# EAGLE schematic powersupplyboardinprogress (EAGLE 8.6.0)
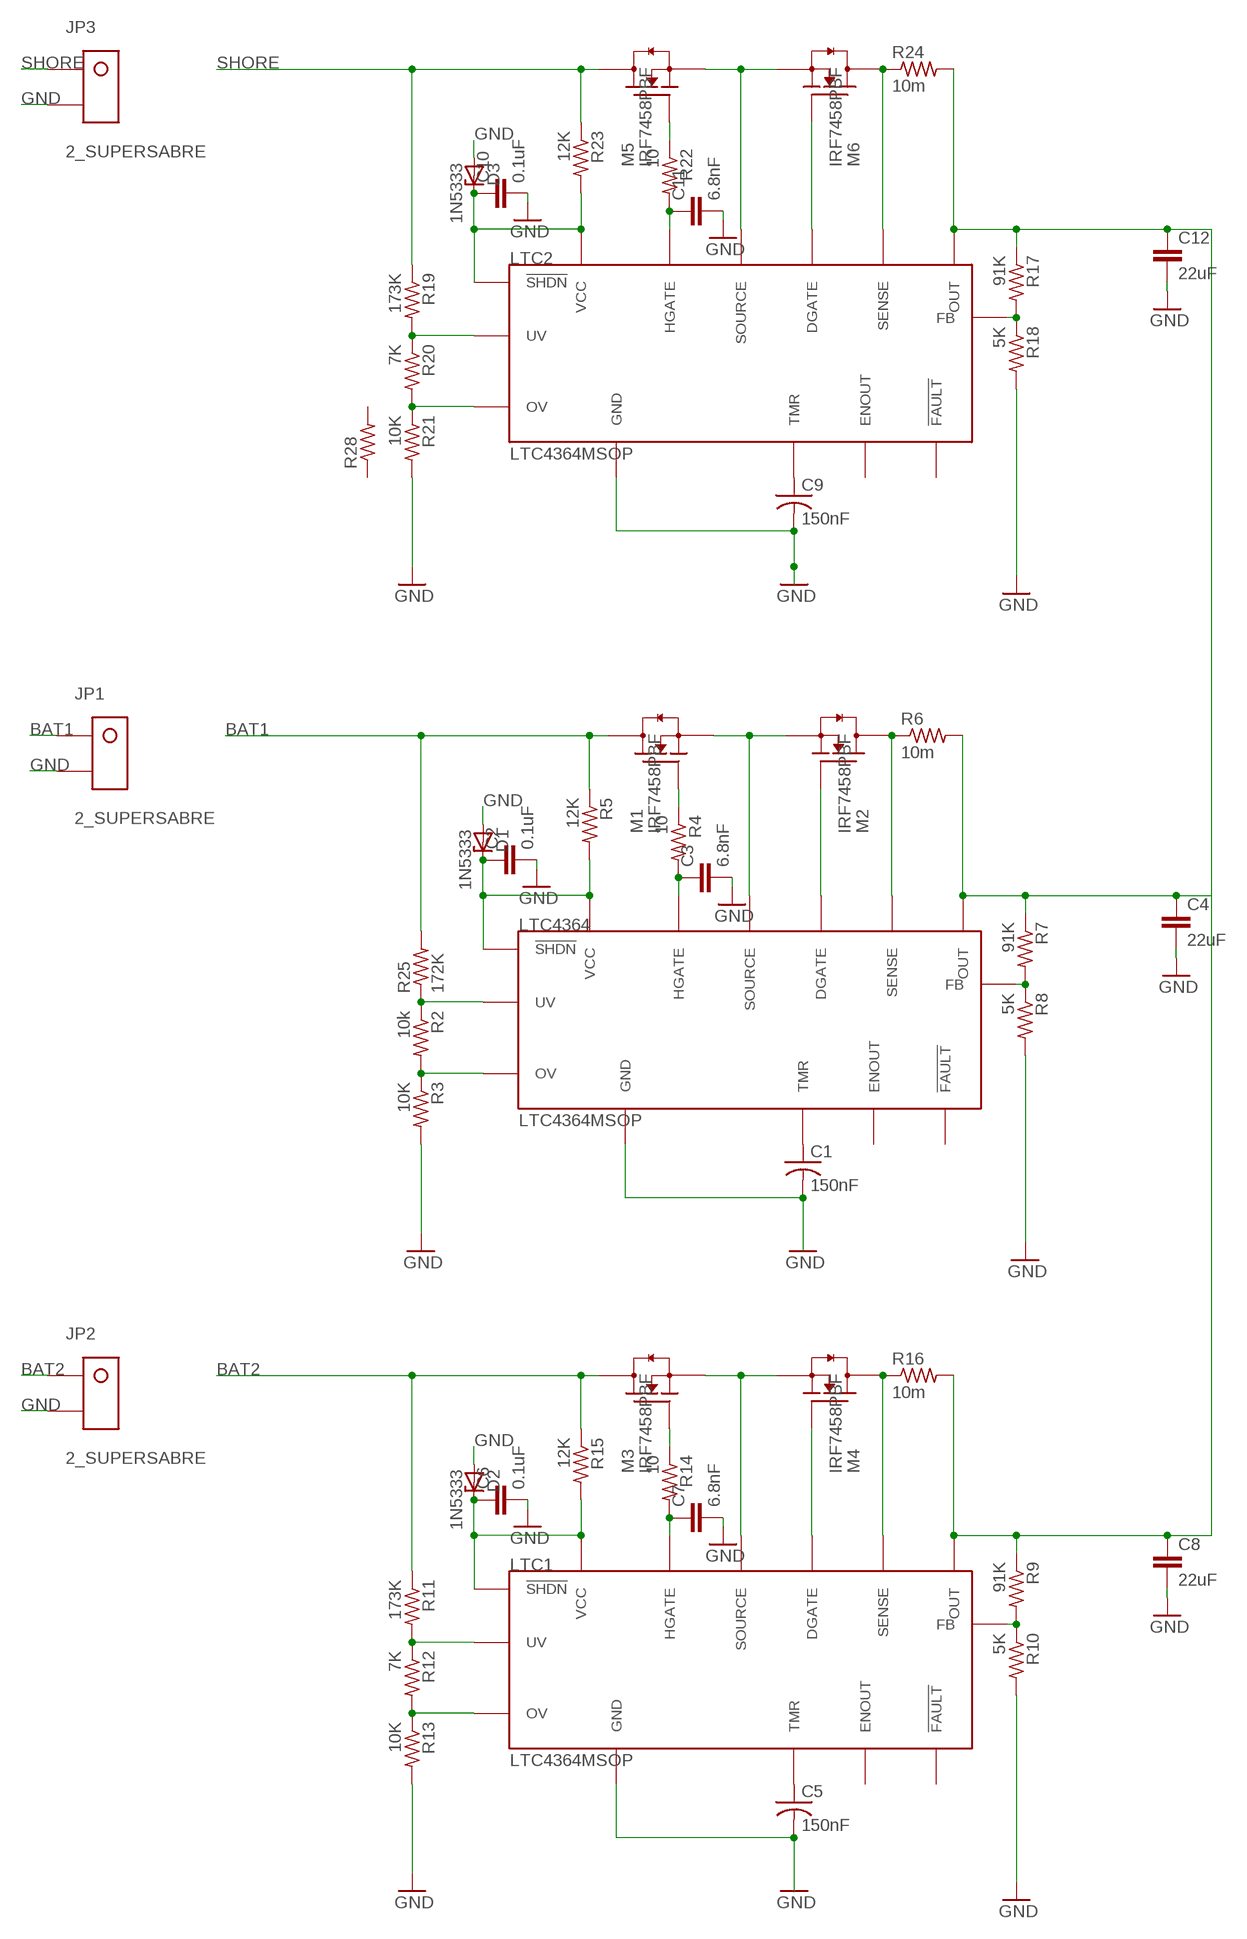
[diagram p0: schematic, sheet 1]

## Parts
C1  150nF  C-USC0805  [C0805]
C2  0.1uF  C-EUC0805  [C0805]
C3  6.8nF  C-EUC0805  [C0805]
C4  22uF  C-EUC0805  [C0805]
C5  150nF  C-USC0805  [C0805]
C6  0.1uF  C-EUC0805  [C0805]
C7  6.8nF  C-EUC0805  [C0805]
C8  22uF  C-EUC0805  [C0805]
C9  150nF  C-USC0805  [C0805]
C10  0.1uF  C-EUC0805  [C0805]
C11  6.8nF  C-EUC0805  [C0805]
C12  22uF  C-EUC0805  [C0805]
D1  1N5333  [C1702-15]
D2  1N5333  [C1702-15]
D3  1N5333  [C1702-15]
JP1  2_SUPERSABRE  [SUPERSABRE_2CIRCUIT]
JP2  2_SUPERSABRE  [SUPERSABRE_2CIRCUIT]
JP3  2_SUPERSABRE  [SUPERSABRE_2CIRCUIT]
LTC1  LTC4364MSOP  [MSOP16]
LTC2  LTC4364MSOP  [MSOP16]
LTC4364  LTC4364MSOP  [MSOP16]
M1  IRF7458PBF  [SOIC8]
M2  IRF7458PBF  [SOIC8]
M3  IRF7458PBF  [SOIC8]
M4  IRF7458PBF  [SOIC8]
M5  IRF7458PBF  [SOIC8]
M6  IRF7458PBF  [SOIC8]
R2  10k  R-US_R0805  [R0805]
R3  10K  R-US_R0805  [R0805]
R4  10  R-US_R0805  [R0805]
R5  12K  R-US_R0805  [R0805]
R6  10m  R-US_R0805  [R0805]
R7  91K  R-US_R0805  [R0805]
R8  5K  R-US_R0805  [R0805]
R9  91K  R-US_R0805  [R0805]
R10  5K  R-US_R0805  [R0805]
R11  173K  R-US_R0805  [R0805]
R12  7K  R-US_R0805  [R0805]
R13  10K  R-US_R0805  [R0805]
R14  10  R-US_R0805  [R0805]
R15  12K  R-US_R0805  [R0805]
R16  10m  R-US_R0805  [R0805]
R17  91K  R-US_R0805  [R0805]
R18  5K  R-US_R0805  [R0805]
R19  173K  R-US_R0805  [R0805]
R20  7K  R-US_R0805  [R0805]
R21  10K  R-US_R0805  [R0805]
R22  10  R-US_R0805  [R0805]
R23  12K  R-US_R0805  [R0805]
R24  10m  R-US_R0805  [R0805]
R25  172K  R-US_R0603  [R0603]
R28  R-US_R0603  [R0603]

## Nets
BAT1: JP1.P$1 M1.D1(D) M1.D2(D) M1.D3(D) M1.D4(D) R5.1 R25.2
BAT2: JP2.P$1 M3.D1(D) M3.D2(D) M3.D3(D) M3.D4(D) R11.1 R15.1
GND: C1.2 C2.2 C3.2 C4.2 C5.2 C6.2 C7.2 C8.2 C9.2 C10.2 C11.2 C12.2 D1.A D2.A D3.A JP1.P$2 JP2.P$2 JP3.P$2 LTC1.GND LTC2.GND LTC4364.GND R3.2 R8.2 R10.2 R13.2 R18.2 R21.2
N$1: LTC4364.DGATE M2.G1(G)
N$2: LTC4364.SOURCE M1.S1(S) M1.S2(S) M1.S3(S) M2.S1(S) M2.S2(S) M2.S3(S)
N$3: C1.1 LTC4364.TMR
N$4: LTC4364.UV R2.1 R25.1
N$5: LTC4364.OV R2.2 R3.1
N$6: M1.G1(G) R4.1
N$7: LTC4364.FB R7.2 R8.1
N$8: C3.1 LTC4364.HGATE R4.2
N$9: C9.1 LTC2.TMR
N$10: C2.1 D1.C LTC4364.SHDN(!SHDN!) LTC4364.VCC R5.2
N$11: LTC4364.SENSE M2.D1(D) M2.D2(D) M2.D3(D) M2.D4(D) R6.1
N$12: C5.1 LTC1.TMR
N$13: LTC1.DGATE M4.G1(G)
N$14: LTC1.SOURCE M3.S1(S) M3.S2(S) M3.S3(S) M4.S1(S) M4.S2(S) M4.S3(S)
N$15: C4.1 C8.1 C12.1 LTC1.OUT LTC2.OUT LTC4364.OUT R6.2 R7.1 R9.1 R16.2 R17.1 R24.2
N$16: LTC1.FB R9.2 R10.1
N$17: LTC1.UV R11.2 R12.1
N$18: LTC1.OV R12.2 R13.1
N$19: M3.G1(G) R14.1
N$20: C7.1 LTC1.HGATE R14.2
N$21: C6.1 D2.C LTC1.SHDN(!SHDN!) LTC1.VCC R15.2
N$22: LTC1.SENSE M4.D1(D) M4.D2(D) M4.D3(D) M4.D4(D) R16.1
N$23: LTC2.DGATE M6.G1(G)
N$24: LTC2.SOURCE M5.S1(S) M5.S2(S) M5.S3(S) M6.S1(S) M6.S2(S) M6.S3(S)
N$26: LTC2.FB R17.2 R18.1
N$27: LTC2.UV R19.2 R20.1
N$28: LTC2.OV R20.2 R21.1
N$29: M5.G1(G) R22.1
N$30: C11.1 LTC2.HGATE R22.2
N$31: C10.1 D3.C LTC2.SHDN(!SHDN!) LTC2.VCC R23.2
N$32: LTC2.SENSE M6.D1(D) M6.D2(D) M6.D3(D) M6.D4(D) R24.1
SHORE: JP3.P$1 M5.D1(D) M5.D2(D) M5.D3(D) M5.D4(D) R19.1 R23.1
Unconnected: LTC1.ENOUT LTC1.FLT(!FAULT!) LTC2.ENOUT LTC2.FLT(!FAULT!) LTC4364.ENOUT LTC4364.FLT(!FAULT!) R28.1 R28.2

## Library data of the parts
C1 C5 C9 = resistor:C-US: CAPACITOR, American symbol; SPICEPREFIX: C
C2-C4 C6-C8 C10-C12 = resistor:C-EU: CAPACITOR, European symbol
D1-D3 = diode:1N5333: Z DIODE 3.3 V, 5W, 5 percent (Motorola)
JP1-JP3 = molex:2_SUPERSABRE: Molex SuperSabre 2-pin vertical header
LTC1 LTC2 LTC4364 = linear:LTC4364; SPICEPREFIX: X
M1-M6 = transistor-fet:IRF7458PBF: N-Channel Enhancement Type MOSFET; SPICEPREFIX: M
R2-R25 R28 = resistor:R-US_: RESISTOR, American symbol